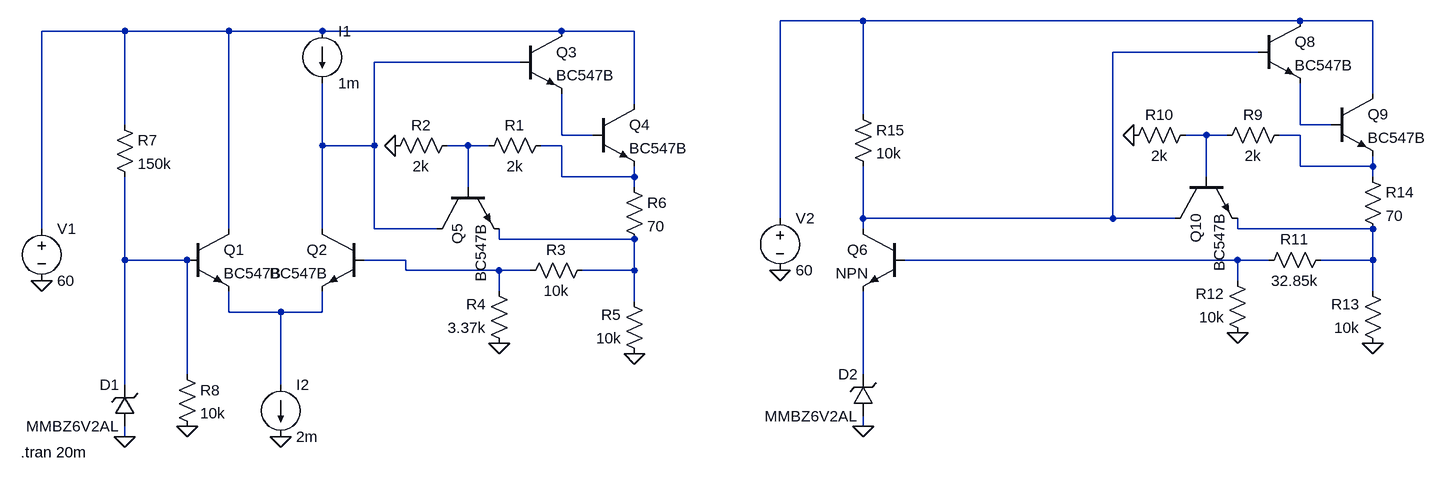
[diagram p0: schematic ReguladorConLimitador.asc]
ReguladorConLimitador.asc, the LTspice schematic file:
Version 4
SHEET 1 2056 680
WIRE 1184 -176 1056 -176
WIRE 1856 -176 1184 -176
WIRE 1968 -176 1856 -176
WIRE 48 -160 -80 -160
WIRE 208 -160 48 -160
WIRE 352 -160 208 -160
WIRE 720 -160 352 -160
WIRE 832 -160 720 -160
WIRE 1792 -128 1568 -128
WIRE 656 -112 432 -112
WIRE 1968 -64 1968 -176
WIRE 832 -48 832 -160
WIRE 1184 -32 1184 -176
WIRE 48 -16 48 -160
WIRE 1856 -16 1856 -80
WIRE 1904 -16 1856 -16
WIRE 720 0 720 -64
WIRE 768 0 720 0
WIRE 1712 0 1680 0
WIRE 1744 0 1712 0
WIRE 1856 0 1824 0
WIRE 352 16 352 -80
WIRE 432 16 432 -112
WIRE 432 16 352 16
WIRE 576 16 544 16
WIRE 608 16 576 16
WIRE 720 16 688 16
WIRE 1856 48 1856 0
WIRE 1968 48 1968 32
WIRE 1968 48 1856 48
WIRE 720 64 720 16
WIRE 832 64 832 48
WIRE 832 64 720 64
WIRE 1712 64 1712 0
WIRE 1968 64 1968 48
WIRE 576 80 576 16
WIRE 832 80 832 64
WIRE 1056 128 1056 -176
WIRE 1184 128 1184 48
WIRE 1568 128 1568 -128
WIRE 1568 128 1184 128
WIRE 1664 128 1568 128
WIRE -80 144 -80 -160
WIRE 208 144 208 -160
WIRE 352 144 352 16
WIRE 432 144 432 16
WIRE 528 144 432 144
WIRE 1184 144 1184 128
WIRE 1760 144 1760 128
WIRE 1968 144 1760 144
WIRE 624 160 624 144
WIRE 832 160 624 160
WIRE 48 192 48 64
WIRE 144 192 48 192
WIRE 480 192 416 192
WIRE 1760 192 1248 192
WIRE 1808 192 1760 192
WIRE 1968 192 1968 144
WIRE 1968 192 1888 192
WIRE 480 208 480 192
WIRE 624 208 480 208
WIRE 672 208 624 208
WIRE 832 208 832 160
WIRE 832 208 752 208
WIRE 1760 224 1760 192
WIRE 624 240 624 208
WIRE 1968 240 1968 192
WIRE 832 256 832 208
WIRE 208 272 208 240
WIRE 288 272 208 272
WIRE 352 272 352 240
WIRE 352 272 288 272
WIRE 144 368 144 192
WIRE 1184 368 1184 240
WIRE 48 384 48 192
WIRE 288 384 288 272
WIRE 1184 448 1184 432
WIRE 48 464 48 448
FLAG 464 16 0
FLAG 832 336 0
FLAG 624 320 0
FLAG 48 464 0
FLAG 288 464 0
FLAG -80 224 0
FLAG 144 448 0
FLAG 1600 0 0
FLAG 1968 320 0
FLAG 1760 304 0
FLAG 1184 448 0
FLAG 1056 208 0
SYMBOL voltage -80 128 R0
WINDOW 123 0 0 Left 0
WINDOW 39 0 0 Left 0
SYMATTR InstName V1
SYMATTR Value 60
SYMBOL npn 144 144 R0
SYMATTR InstName Q1
SYMATTR Value BC547B
SYMBOL npn 416 144 M0
SYMATTR InstName Q2
SYMATTR Value BC547B
SYMBOL current 352 -160 R0
WINDOW 123 0 0 Left 0
WINDOW 39 0 0 Left 0
SYMATTR InstName I1
SYMATTR Value 1m
SYMBOL current 288 384 R0
WINDOW 123 0 0 Left 0
WINDOW 39 0 0 Left 0
SYMATTR InstName I2
SYMATTR Value 2m
SYMBOL npn 656 -160 R0
SYMATTR InstName Q3
SYMATTR Value BC547B
SYMBOL npn 768 -48 R0
SYMATTR InstName Q4
SYMATTR Value BC547B
SYMBOL npn 528 80 M90
SYMATTR InstName Q5
SYMATTR Value BC547B
SYMBOL res 704 0 R90
WINDOW 0 0 56 VBottom 2
WINDOW 3 32 56 VTop 2
SYMATTR InstName R1
SYMATTR Value 2k
SYMBOL res 560 0 R90
WINDOW 0 0 56 VBottom 2
WINDOW 3 32 56 VTop 2
SYMATTR InstName R2
SYMATTR Value 2k
SYMBOL res 768 192 R90
WINDOW 0 0 56 VBottom 2
WINDOW 3 32 56 VTop 2
SYMATTR InstName R3
SYMATTR Value 10k
SYMBOL res 640 336 R180
WINDOW 0 36 76 Left 2
WINDOW 3 36 40 Left 2
SYMATTR InstName R4
SYMATTR Value 3.37k
SYMBOL res 848 352 R180
WINDOW 0 36 76 Left 2
WINDOW 3 36 40 Left 2
SYMATTR InstName R5
SYMATTR Value 10k
SYMBOL res 816 64 R0
SYMATTR InstName R6
SYMATTR Value 70
SYMBOL zener 64 448 R180
WINDOW 0 24 64 Left 2
WINDOW 3 24 0 Left 2
SYMATTR InstName D1
SYMATTR Value MMBZ6V2AL
SYMATTR Description Diode
SYMATTR Type diode
SYMBOL res 32 -32 R0
SYMATTR InstName R7
SYMATTR Value 150k
SYMBOL res 128 352 R0
SYMATTR InstName R8
SYMATTR Value 10k
SYMBOL voltage 1056 112 R0
WINDOW 123 0 0 Left 0
WINDOW 39 0 0 Left 0
SYMATTR InstName V2
SYMATTR Value 60
SYMBOL npn 1792 -176 R0
SYMATTR InstName Q8
SYMATTR Value BC547B
SYMBOL npn 1904 -64 R0
SYMATTR InstName Q9
SYMATTR Value BC547B
SYMBOL npn 1664 64 M90
SYMATTR InstName Q10
SYMATTR Value BC547B
SYMBOL res 1840 -16 R90
WINDOW 0 0 56 VBottom 2
WINDOW 3 32 56 VTop 2
SYMATTR InstName R9
SYMATTR Value 2k
SYMBOL res 1696 -16 R90
WINDOW 0 0 56 VBottom 2
WINDOW 3 32 56 VTop 2
SYMATTR InstName R10
SYMATTR Value 2k
SYMBOL res 1904 176 R90
WINDOW 0 0 56 VBottom 2
WINDOW 3 32 56 VTop 2
SYMATTR InstName R11
SYMATTR Value 32.85k
SYMBOL res 1776 320 R180
WINDOW 0 36 76 Left 2
WINDOW 3 36 40 Left 2
SYMATTR InstName R12
SYMATTR Value 10k
SYMBOL res 1984 336 R180
WINDOW 0 36 76 Left 2
WINDOW 3 36 40 Left 2
SYMATTR InstName R13
SYMATTR Value 10k
SYMBOL res 1952 48 R0
SYMATTR InstName R14
SYMATTR Value 70
SYMBOL zener 1200 432 R180
WINDOW 0 24 64 Left 2
WINDOW 3 24 0 Left 2
SYMATTR InstName D2
SYMATTR Value MMBZ6V2AL
SYMATTR Description Diode
SYMATTR Type diode
SYMBOL res 1168 -48 R0
SYMATTR InstName R15
SYMATTR Value 10k
SYMBOL npn 1248 144 M0
SYMATTR InstName Q6
TEXT -112 488 Left 2 !.tran 20m

The netlist it stands for:
* ReguladorConLimitador.asc
V1 N002 0 60
Q1 N002 N013 N016 0 BC547B
Q2 N004 N014 N016 0 BC547B
I1 N002 N004 1m
I2 N016 0 2m
Q3 N002 N004 N006 0 BC547B
Q4 N002 N006 N010 0 BC547B
Q5 N004 N009 N012 0 BC547B
R1 N010 N009 2k
R2 N009 0 2k
R3 N012 N014 10k
R4 0 N014 3.37k
R5 0 N012 10k
R6 N010 N012 70
D1 0 N013 MMBZ6V2AL
R7 N002 N013 150k
R8 N013 0 10k
V2 N001 0 60
Q8 N001 N003 N005 0 BC547B
Q9 N001 N005 N008 0 BC547B
Q10 N003 N007 N011 0 BC547B
R9 N008 N007 2k
R10 N007 0 2k
R11 N011 N015 32.85k
R12 0 N015 10k
R13 0 N011 10k
R14 N008 N011 70
D2 0 N017 MMBZ6V2AL
R15 N001 N003 10k
Q6 N003 N015 N017 0 NPN
.model D D
.lib standard.dio
.model NPN NPN
.model PNP PNP
.lib standard.bjt
.tran 20m
.backanno
.end